# Altium project PROC114E3_SCH.PrjPcb (part 9 of 22)

## Sheet 22.SchDoc
size 513 x 386 mm
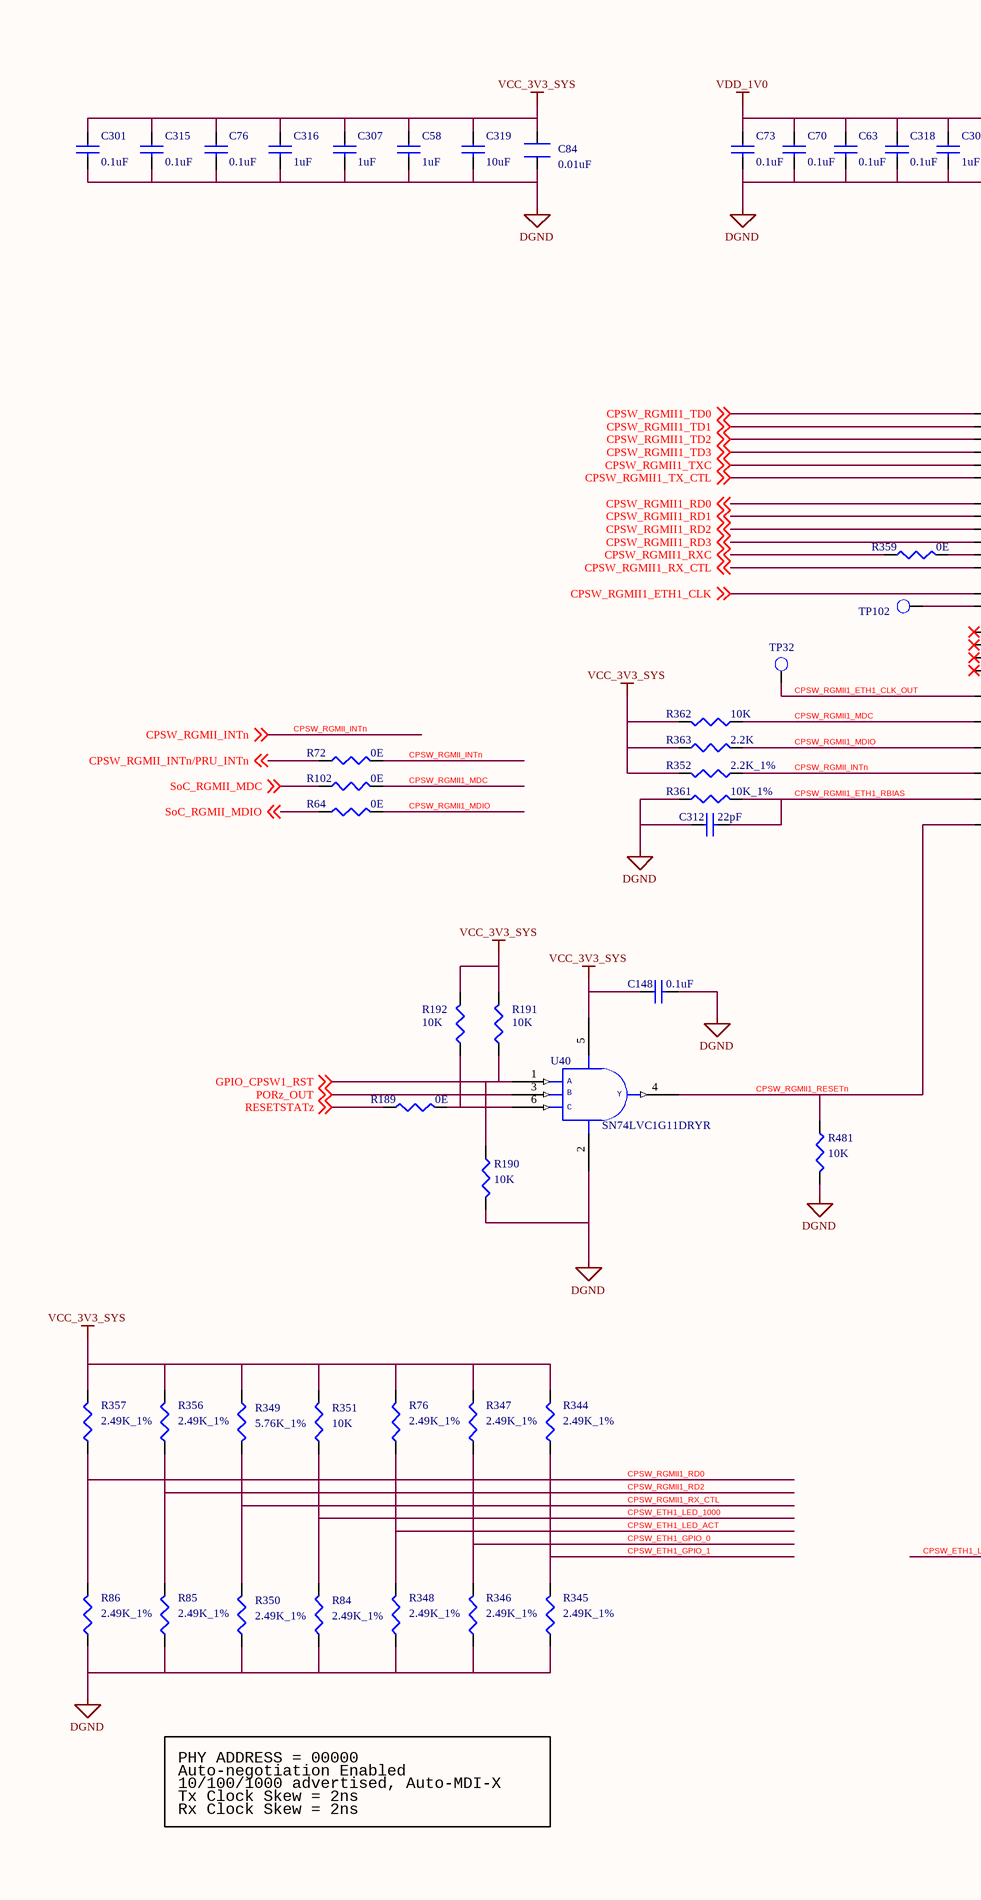
[diagram p33: 22.SchDoc, left]
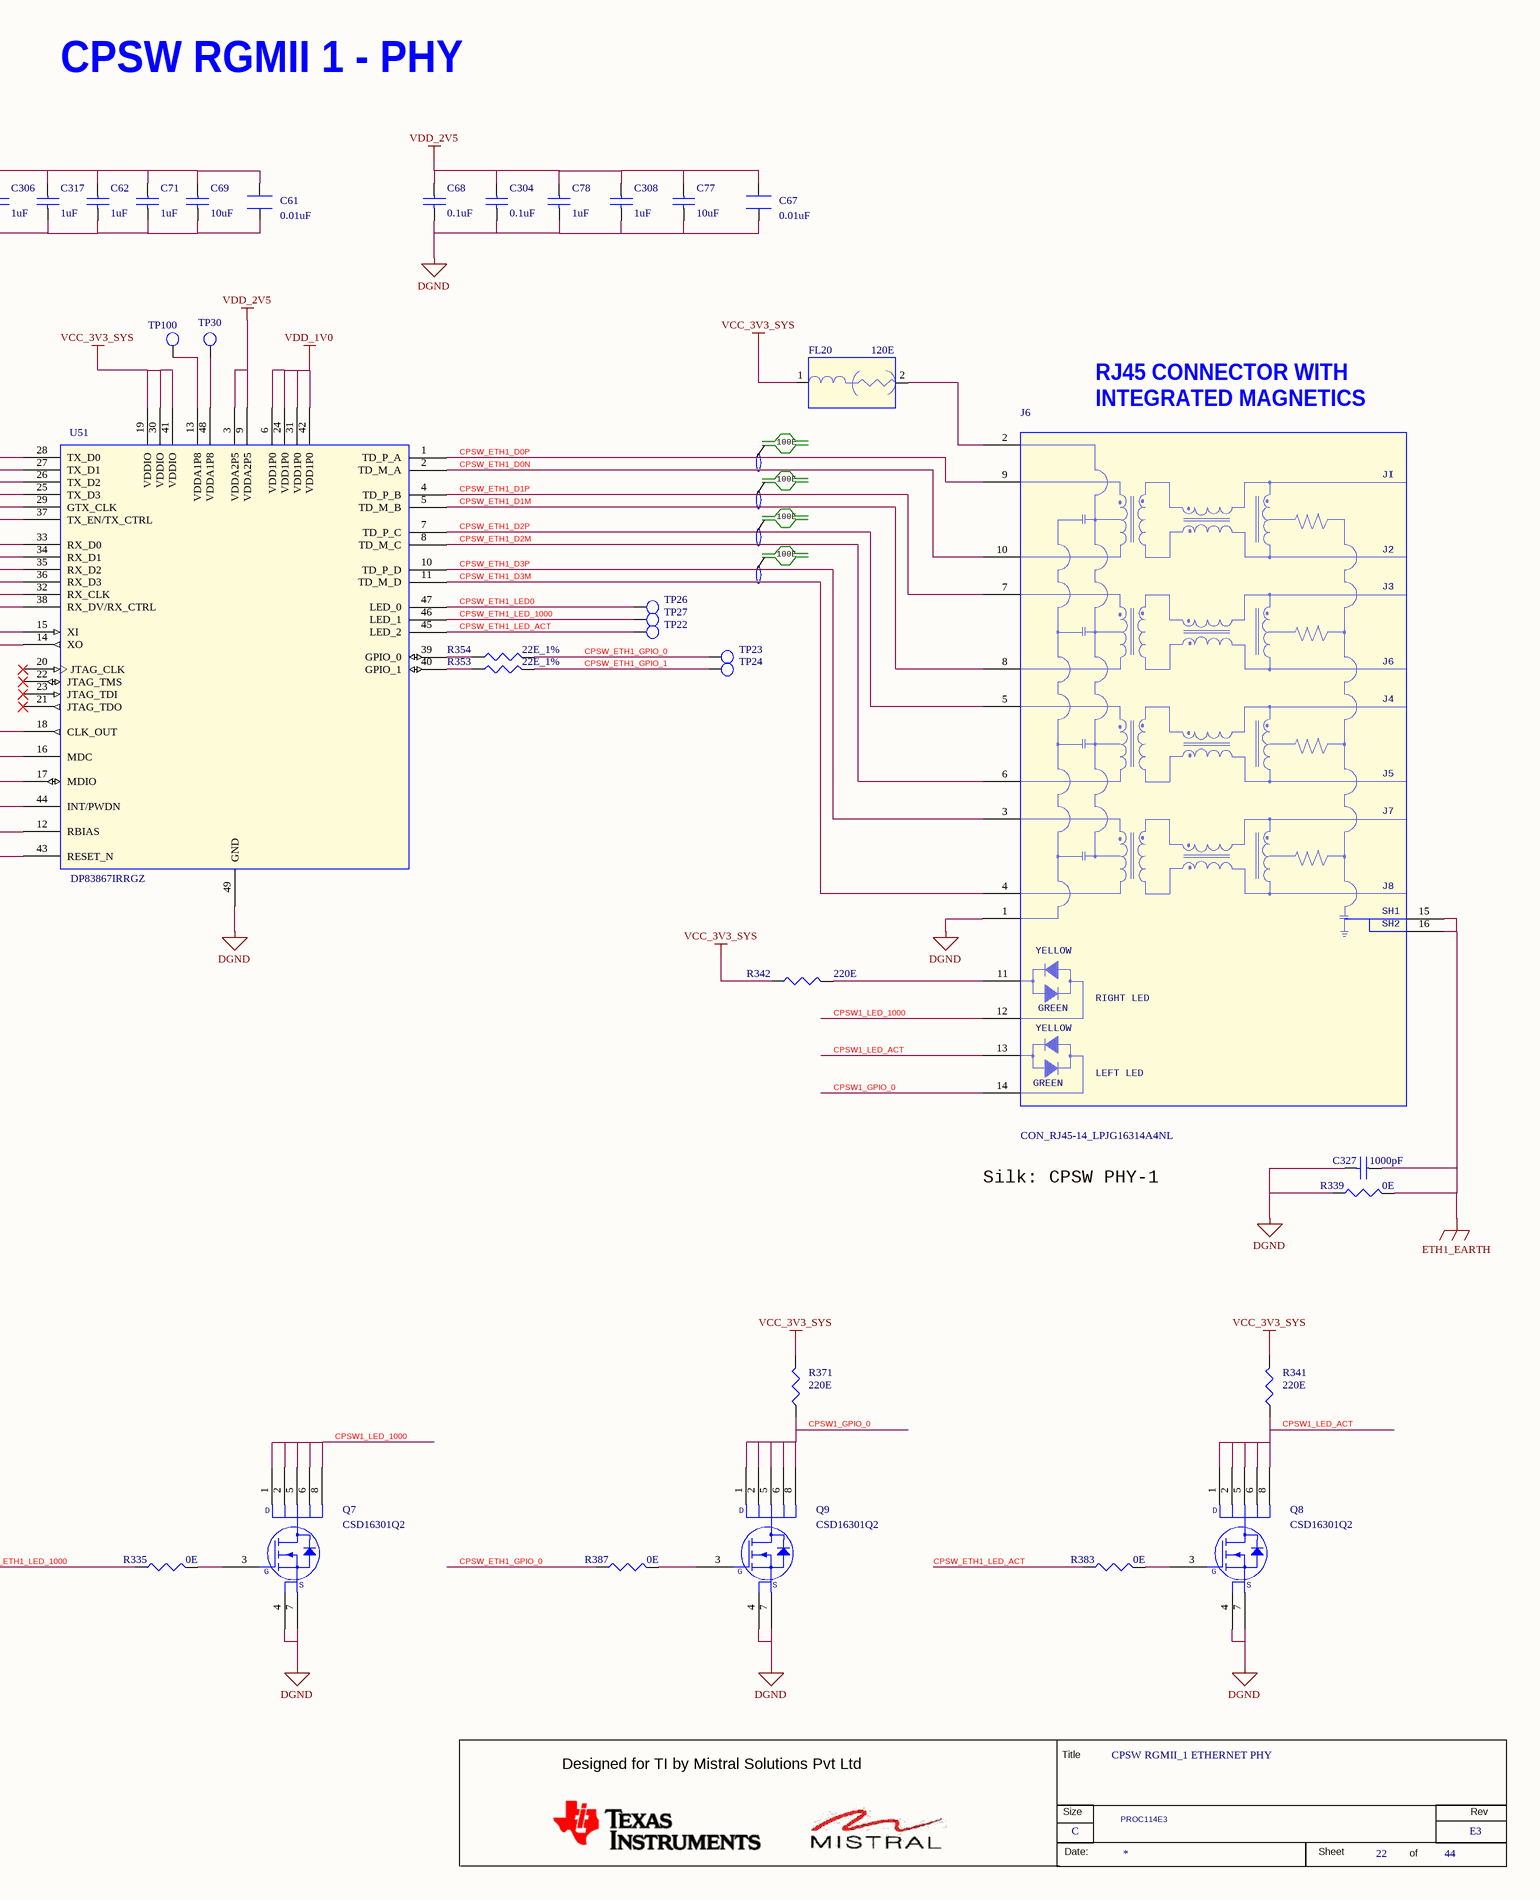
[diagram p34: 22.SchDoc, right]

### Parts
(Parts that share a designator on the sheet are numbered #1, #2 ... from top to bottom, then left to right.)
*#22  RevCode: E3  Title: CPSW RGMII_1 ETHERNET PHY  Page Size: C  Page Number: 22  Page Count: 44  Variant Name: PROC114E3  (hidden comment: MISTRAL_TITLEBLK_CSIZE)  (graphical)
C58  1uF  [CAP0201_0-5]
C61  0.01uF  [CAP0402N]
C62  1uF  [CAP0201_0-5]
C63  0.1uF  [CAP0201_0-5]
C67  0.01uF  [CAP0402N]
C68  0.1uF  [CAP0201_0-5]
C69  10uF  [CAP0402_0-75]
C70  0.1uF  [CAP0201_0-5]
C71  1uF  [CAP0201_0-5]
C73  0.1uF  [CAP0201_0-5]
C76  0.1uF  [CAP0201_0-5]
C77  10uF  [CAP0402_0-75]
C78  1uF  [CAP0201_0-5]
C84  0.01uF  [CAP0402N]
C148  0.1uF  [CAP0201_0-5]
C301  0.1uF  [CAP0201_0-5]
C304  0.1uF  [CAP0201_0-5]
C306  1uF  [CAP0201_0-5]
C307  1uF  [CAP0201_0-5]
C308  1uF  [CAP0201_0-5]
C312  22pF  [CAP0201_0-5]
C315  0.1uF  [CAP0201_0-5]
C316  1uF  [CAP0201_0-5]
C317  1uF  [CAP0201_0-5]
C318  0.1uF  [CAP0201_0-5]
C319  10uF  [CAP0402_0-75]
C327  1000pF  [CAP1206_1-75]
FL20  120E  [EMIFIL_BLM15P_0402]
J6  CON_RJ45-14_LPJG16314A4NL  [CON_RJ45-14_LPJG16314A4NL_S_R_T_13-6]
Q7  CSD16301Q2  [WSON6_CSD13202Q2_80X80_0-8]
Q8  CSD16301Q2  [WSON6_CSD13202Q2_80X80_0-8]
Q9  CSD16301Q2  [WSON6_CSD13202Q2_80X80_0-8]
R64  0E  [RES0402_0-5]
R72  0E  [RES0402_0-5]
R76  2.49K_1%  [RES0402_0-5]
R84  2.49K_1%  [RES0402_0-5]
R85  2.49K_1%  [RES0402_0-5]
R86  2.49K_1%  [RES0402_0-5]
R102  0E  [RES0402_0-5]
R189  0E  [RES0402_0-5]
R190  10K  [RES0201_0-5]
R191  10K  [RES0201_0-5]
R192  10K  [RES0201_0-5]
R335  0E  [RES0402_0-5]
R339  0E  [RES0603_0-75]
R341  220E  [RES0402_0-5]
R342  220E  [RES0402_0-5]
R344  2.49K_1%  [RES0402_0-5]
R345  2.49K_1%  [RES0402_0-5]
R346  2.49K_1%  [RES0402_0-5]
R347  2.49K_1%  [RES0402_0-5]
R348  2.49K_1%  [RES0402_0-5]
R349  5.76K_1%  [RES0402_0-5]
R350  2.49K_1%  [RES0402_0-5]
R351  10K  [RES0201_0-5]
R352  2.2K_1%  [RES0201_0-5]
R353  22E_1%  [RES0201_0-5]
R354  22E_1%  [RES0201_0-5]
R356  2.49K_1%  [RES0402_0-5]
R357  2.49K_1%  [RES0402_0-5]
R359  0E  [RES0402_0-5]
R361  10K_1%  [RES0201_0-5]
R362  10K  [RES0201_0-5]
R363  2.2K  [RES0201_0-5]
R371  220E  [RES0402_0-5]
R383  0E  [RES0402_0-5]
R387  0E  [RES0402_0-5]
R481  10K  [RES0201_0-5]
TP22  TP20_SMD  [TP20_SMD]  (value not drawn)
TP23  TP20_SMD  [TP20_SMD]  (value not drawn)
TP24  TP20_SMD  [TP20_SMD]  (value not drawn)
TP26  TP20_SMD  [TP20_SMD]  (value not drawn)
TP27  TP20_SMD  [TP20_SMD]  (value not drawn)
TP30  TP20_SMD  [TP20_SMD]  (value not drawn)
TP32  TP20_SMD  [TP20_SMD]  (value not drawn)
TP100  TP20_SMD  [TP20_SMD]  (value not drawn)
TP102  TP20_SMD  [TP20_SMD]  (value not drawn)
U40  SN74LVC1G11DRYR  [SON6_SN74LVC2G17_40X60_0-6]
U51  DP83867IRRGZ  [QFN48_19-68_280X280_1]

### Nets
DGND: C58.2 C61.2 C62.2 C63.2 C67.2 C68.2 C69.2 C70.2 C71.2 C73.2 C76.2 C77.2 C78.2 C84.2 C148.2 C301.2 C304.2 C306.2 C307.2 C308.2 C312.1 C315.2 C316.2 C317.2 C318.2 C319.2 C327.2 J6.1(CH-GND) Q7.4(S1) Q7.7(S2) Q8.4(S1) Q8.7(S2) Q9.4(S1) Q9.7(S2) R84.1 R85.1 R86.1 R190.2 R339.2 R345.1 R346.1 R348.1 R350.1 R361.2 R481.2 U40.2(GND) U51.49(GND)
ETH1_EARTH: C327.1 J6.15(SH1) J6.16(SH2) R339.1
VCC_3V3_SYS: C58.1 C76.1 C84.1 C148.1 C301.1 C307.1 C315.1 C316.1 C319.1 FL20.1 R76.2 R191.2 R192.2 R341.2 R342.1 R344.2 R347.2 R349.1 R351.2 R352.2 R356.2 R357.2 R362.2 R363.1 R371.2 U40.5(VCC) U51.19(VDDIO) U51.30(VDDIO) U51.41(VDDIO)
VDD_1V0: C61.1 C62.1 C63.1 C69.1 C70.1 C71.1 C73.1 C306.1 C317.1 C318.1 U51.6(VDD1P0) U51.24(VDD1P0) U51.31(VDD1P0) U51.42(VDD1P0)
VDD_2V5: C67.1 C68.1 C77.1 C78.1 C304.1 C308.1 U51.3(VDDA2P5) U51.9(VDDA2P5)
CPSW1_GPIO_0: J6.14 Q9.1(D1) Q9.2(D2) Q9.5(D3) Q9.6(D4) Q9.8(D5) R371.1
CPSW1_LED_1000: J6.12 Q7.1(D1) Q7.2(D2) Q7.5(D3) Q7.6(D4) Q7.8(D5)
CPSW1_LED_ACT: J6.13 Q8.1(D1) Q8.2(D2) Q8.5(D3) Q8.6(D4) Q8.8(D5) R341.1
CPSW_ETH1_D0N: J6.10(MX0-) U51.2(TD_M_A)
CPSW_ETH1_D0P: J6.9(MX0+) U51.1(TD_P_A)
CPSW_ETH1_D1M: J6.8(MX1-) U51.5(TD_M_B)
CPSW_ETH1_D1P: J6.7(MX1+) U51.4(TD_P_B)
CPSW_ETH1_D2M: J6.6(MX2-) U51.8(TD_M_C)
CPSW_ETH1_D2P: J6.5(MX2+) U51.7(TD_P_C)
CPSW_ETH1_D3M: J6.4(MX3-) U51.11(TD_M_D)
CPSW_ETH1_D3P: J6.3(MX3+) U51.10(TD_P_D)
CPSW_ETH1_GPIO_0: R346.2 R347.1 R354.1 R387.1 TP23.1(TP)
CPSW_ETH1_GPIO_1: R344.1 R345.2 R353.1 TP24.1(TP)
CPSW_ETH1_LED0: TP26.1(TP) U51.47(LED_0)
CPSW_ETH1_LED_1000: R84.2 R335.1 R351.1 TP27.1(TP) U51.46(LED_1)
CPSW_ETH1_LED_ACT: R76.1 R348.2 R383.1 TP22.1(TP) U51.45(LED_2)
CPSW_RGMII1_ETH1_CLK: U51.15(XI) ; off-sheet CPSW_RGMII1_ETH1_CLK
CPSW_RGMII1_ETH1_CLK_OUT: TP32.1(TP) U51.18(CLK_OUT)
CPSW_RGMII1_ETH1_RBIAS: C312.2 R361.1 U51.12(RBIAS)
CPSW_RGMII1_MDC: R102.2 R362.1 U51.16(MDC)
CPSW_RGMII1_MDIO: R64.2 R363.2 U51.17(MDIO)
CPSW_RGMII1_RD0: R86.2 R357.1 U51.33(RX_D0) ; off-sheet CPSW_RGMII1_RD0
CPSW_RGMII1_RD1: U51.34(RX_D1) ; off-sheet CPSW_RGMII1_RD1
CPSW_RGMII1_RD2: R85.2 R356.1 U51.35(RX_D2) ; off-sheet CPSW_RGMII1_RD2
CPSW_RGMII1_RD3: U51.36(RX_D3) ; off-sheet CPSW_RGMII1_RD3
CPSW_RGMII1_RESETn: R481.1 U40.4(Y) U51.43(RESET_N)
CPSW_RGMII1_RX_CTL: R349.2 R350.2 U51.38(RX_DV/RX_CTRL) ; off-sheet CPSW_RGMII1_RX_CTL
CPSW_RGMII1_RXC: R359.1 ; off-sheet CPSW_RGMII1_RXC
CPSW_RGMII1_TD0: U51.28(TX_D0) ; off-sheet CPSW_RGMII1_TD0
CPSW_RGMII1_TD1: U51.27(TX_D1) ; off-sheet CPSW_RGMII1_TD1
CPSW_RGMII1_TD2: U51.26(TX_D2) ; off-sheet CPSW_RGMII1_TD2
CPSW_RGMII1_TD3: U51.25(TX_D3) ; off-sheet CPSW_RGMII1_TD3
CPSW_RGMII1_TX_CTL: U51.37(TX_EN/TX_CTRL) ; off-sheet CPSW_RGMII1_TX_CTL
CPSW_RGMII1_TXC: U51.29(GTX_CLK) ; off-sheet CPSW_RGMII1_TXC
CPSW_RGMII_INTn: R72.2 R352.1 U51.44(INT/PWDN) ; off-sheet CPSW_RGMII_INTn
CPSW_RGMII_INTn/PRU_INTn: R72.1 ; off-sheet CPSW_RGMII_INTn/PRU_INTn
GPIO_CPSW1_RST: R190.1 R191.1 U40.1(A) ; off-sheet GPIO_CPSW1_RST
PORz_OUT: U40.3(B) ; off-sheet PORz_OUT
RESETSTATz: R189.1 ; off-sheet RESETSTATz
SoC_RGMII_MDC: R102.1 ; off-sheet SoC_RGMII_MDC
SoC_RGMII_MDIO: R64.1 ; off-sheet SoC_RGMII_MDIO
NetFL20_2: FL20.2 J6.2(VCC)
NetJ6_11: J6.11 R342.2
NetQ7_3: Q7.3(G) R335.2
NetQ8_3: Q8.3(G) R383.2
NetQ9_3: Q9.3(G) R387.2
NetR189_2: R189.2 R192.1 U40.6(C)
NetR353_2: R353.2 U51.40(GPIO_1)
NetR354_2: R354.2 U51.39(GPIO_0)
NetR359_2: R359.2 U51.32(RX_CLK)
NetTP30_1: TP30.1(TP) U51.48(VDDA1P8)
NetTP100_1: TP100.1(TP) U51.13(VDDA1P8)
NetTP102_1: TP102.1(TP) U51.14(XO)

Not connected (* = marked no-connect by the designer): U51 20(JTAG_CLK)* 21(JTAG_TDO)* 22(JTAG_TMS)* 23(JTAG_TDI)*

### Notes on the sheet
- CPSW RGMII 1 - PHY
- (near J6) RJ45 CONNECTOR WITH
  INTEGRATED MAGNETICS
- 100E
- Silk: CPSW PHY-1
- Auto-negotiation Enabled
- PHY ADDRESS = 00000
- Rx Clock Skew = 2ns
- Tx Clock Skew = 2ns
- 10/100/1000 advertised, Auto-MDI-X
- (in symbol CON_RJ45-14_LPJG16314A4NL) JI; J2; J3; J4; J5; J7; J8; YELLOW; RIGHT LED; GREEN; LEFT LED
- (in symbol MISTRAL_TITLEBLK_CSIZE) Title; Designed for TI by Mistral Solutions Pvt Ltd; Size; Rev; Date:; Sheet; of
- (in symbol MOSFET_CSD17313Q2) D; S

### Library data of the parts
*#22 = MISTRAL_TITLEBLK_CSIZE: Issue: 1.0; Page Create Date: March  8, 1995; Page Modify Date: *; Schematic Page Count: 44; Schematic Page Number: 22
C58 C62 C306 = CAP_Dup2: as C47 on sheet 19; Chkd/date: MANIRAJA/300520; Crtd /date: ALVY/260520; Datasheet: Y:\MIS_DATABASE\DATASHEETS\CAPACITORS\GRM033R61C105ME15.PDF; Temperature: -55°C+85°C; Weight: 0.33mg; Height: 0.39MM; Distributor_part_number: 490-18654-1-ND; Distributor_name: DIGIKEY; Package: 0201; Voltage: 16V; Tolerance: 20%; MECHANICAL 3D STEP FILE: CAP0201_0-5; Library Path: Y:\MIS_DATABASE\Library\ALTIUM_TOOL\SCHEMATICS_PARTS\MS_DISCRETE_Library.schlib; Footprint Path: Y:\MIS_DATABASE\Library\ALTIUM_TOOL\PCB_FOOTPRINTS\Altium_Footprint_Lib.PcbLib; Library Ref: CAP; Footprint Ref: CAP0201_0-5; PCB Footprint: CAP0201_0-5
C61 C84 = CAP_Dup3: CAP CERAMIC 0.01uF 25V 10% X5R 0201; Mistral Part No: 120018010007-R; Mfr_name: MURATA; Mfr_part_number: GRM033R61E103KA12J; Part_type: CAPACITORS\CERAMIC; Project: TI_MAXIE_CPB; Customs_HS_Code: 85322990; Custom_Duty: 15%; Wattage: NA; MECHANICAL 3D STEP FILE: CAP0201_0-5; Library Ref: CAP; Tolerance: 10%; Voltage: 25V; Package: 0201; Distributor_name: DIGIKEY; Distributor_part_number: GRM033R61E103KA12J-ND; Height: 0.33MM; Datasheet: Y:\MIS_DATABASE\DATASHEETS\CAPACITORS\GRM033R61E103KA12.PDF; Crtd /date: MANIRAJA/230118; Chkd/date: MANIRAJA/230118; Weight: 0.33mg; Temperature: -55°C+85°C; Footprint Ref: CAP0201_0-5; Library Path: Y:\MIS_DATABASE\Library\ALTIUM_TOOL\SCHEMATICS_PARTS\MS_DISCRETE_Library.schlib; Footprint Path: Y:\MIS_DATABASE\Library\ALTIUM_TOOL\PCB_FOOTPRINTS\Altium_Footprint_Lib.PcbLib; PCB Footprint: CAP0201_0-5
C63 C70 C73 C76 C301 C318 = CAP_Dup2: CAP CERAMIC 0.1uF 16V 10% X5R 0201; Alt_Mfr_part_number: CC0402KRX5R8BB104; Mistral Part No: 120009030072-R; Mfr_name: MURATA; Mfr_part_number: GRM033R61C104KE14D; Part_type: CAPACITORS\CERAMIC; Alt_Mfr_name: YAGEO AMERICA; Project: TI_MAXIE_CPB; Wattage: NA; Customs_HS_Code: 85322990; Custom_Duty: 15%; Tolerance: 10%; Voltage: 16V; Package: 0201; Distributor_name: DIGIKEY; Distributor_part_number: 490-14305-1-ND; Height: 0.33MM; Weight: 0.33mg; Temperature: -55°C+85°C; Datasheet: Y:\MIS_DATABASE\DATASHEETS\CAPACITORS\GRM033R61C104KE14.PDF; Crtd /date: MANIRAJA/230118; Chkd/date: MANIRAJA/230118; MECHANICAL 3D STEP FILE: CAP0201_0-5; Library Ref: CAP; Footprint Ref: CAP0201_0-5; Library Path: Y:\MIS_DATABASE\Library\ALTIUM_TOOL\SCHEMATICS_PARTS\MS_DISCRETE_Library.schlib; Footprint Path: Y:\MIS_DATABASE\Library\ALTIUM_TOOL\PCB_FOOTPRINTS\Altium_Footprint_Lib.PcbLib; PCB Footprint: CAP0201_0-5
C67 = CAP_Dup3: CAP CERAMIC 0.01uF 25V 10% X5R 0201; Part_type: CAPACITORS\CERAMIC; Mfr_part_number: GRM033R61E103KA12J; Mfr_name: MURATA; Mistral Part No: 120018010007-R; MECHANICAL 3D STEP FILE: CAP0201_0-5; Wattage: NA; Custom_Duty: 15%; Customs_HS_Code: 85322990; Project: TI_MAXIE_CPB; Footprint Path: Y:\MIS_DATABASE\Library\ALTIUM_TOOL\PCB_FOOTPRINTS\Altium_Footprint_Lib.PcbLib; Library Path: Y:\MIS_DATABASE\Library\ALTIUM_TOOL\SCHEMATICS_PARTS\MS_DISCRETE_Library.schlib; Footprint Ref: CAP0201_0-5; Temperature: -55°C+85°C; Weight: 0.33mg; Chkd/date: MANIRAJA/230118; Crtd /date: MANIRAJA/230118; Datasheet: Y:\MIS_DATABASE\DATASHEETS\CAPACITORS\GRM033R61E103KA12.PDF; Height: 0.33MM; Distributor_part_number: GRM033R61E103KA12J-ND; Distributor_name: DIGIKEY; Package: 0201; Voltage: 25V; Tolerance: 10%; Library Ref: CAP; PCB Footprint: CAP0201_0-5
C68 C148 C304 C315 = CAP_Dup2: CAP CERAMIC 0.1uF 16V 10% X5R 0201; Alt_Mfr_name: YAGEO AMERICA; Part_type: CAPACITORS\CERAMIC; Mfr_part_number: GRM033R61C104KE14D; Mfr_name: MURATA; Mistral Part No: 120009030072-R; Alt_Mfr_part_number: CC0402KRX5R8BB104; Custom_Duty: 15%; Customs_HS_Code: 85322990; Wattage: NA; Project: TI_MAXIE_CPB; Footprint Path: Y:\MIS_DATABASE\Library\ALTIUM_TOOL\PCB_FOOTPRINTS\Altium_Footprint_Lib.PcbLib; Library Path: Y:\MIS_DATABASE\Library\ALTIUM_TOOL\SCHEMATICS_PARTS\MS_DISCRETE_Library.schlib; Footprint Ref: CAP0201_0-5; Library Ref: CAP; MECHANICAL 3D STEP FILE: CAP0201_0-5; Chkd/date: MANIRAJA/230118; Crtd /date: MANIRAJA/230118; Datasheet: Y:\MIS_DATABASE\DATASHEETS\CAPACITORS\GRM033R61C104KE14.PDF; Temperature: -55°C+85°C; Weight: 0.33mg; Height: 0.33MM; Distributor_part_number: 490-14305-1-ND; Distributor_name: DIGIKEY; Package: 0201; Voltage: 16V; Tolerance: 10%; PCB Footprint: CAP0201_0-5
C69 C77 = CAP_Dup2: CAP CERAMIC 10uF 10V 20% X5R 0402; Mistral Part No: 120013110019-R; Mfr_name: MURATA; Mfr_part_number: GRM155R61A106ME11D; Part_type: CAPACITORS\CERAMIC; Project: QCS610_NANOSOM; Customs_HS_Code: 85322990; Custom_Duty: 15%; Wattage: NA; Library Ref: CAP; Tolerance: 20%; Voltage: 10V; Package: 0402; Distributor_name: DIGIKEY; Distributor_part_number: 490-GRM155R61A106ME11DTR-ND; Height: 0.55MM; Datasheet: Y:\MIS_DATABASE\DATASHEETS\CAPACITORS\MURATA-GXX-SER_NOV17.PDF; Crtd /date: ALVY/260520; Chkd/date: MANIRAJA/300520; Weight: 3.1mg; Temperature: -55°C+85°C; MECHANICAL 3D STEP FILE: CAP0402_0-75; Footprint Ref: CAP0402_0-75; Library Path: Y:\MIS_DATABASE\Library\ALTIUM_TOOL\SCHEMATICS_PARTS\MS_DISCRETE_Library.schlib; Footprint Path: Y:\MIS_DATABASE\Library\ALTIUM_TOOL\PCB_FOOTPRINTS\Altium_Footprint_Lib.PcbLib; PCB Footprint: CAP0402_0-75
C71 C78 C307 C308 C316 C317 = CAP_Dup2: CAP CERAMIC 1uF 16V 20% X5R 0201; Mistral Part No: 120018090038-R; Mfr_name: MURATA; Mfr_part_number: GRM033R61C105ME15D; Part_type: CAPACITORS\CERAMIC; Project: QCS610_NANOSOM; Wattage: NA; Customs_HS_Code: 85322990; Custom_Duty: 15%; Footprint Ref: CAP0201_0-5; Library Ref: CAP; Footprint Path: Y:\MIS_DATABASE\Library\ALTIUM_TOOL\PCB_FOOTPRINTS\Altium_Footprint_Lib.PcbLib; Library Path: Y:\MIS_DATABASE\Library\ALTIUM_TOOL\SCHEMATICS_PARTS\MS_DISCRETE_Library.schlib; MECHANICAL 3D STEP FILE: CAP0201_0-5; Tolerance: 20%; Voltage: 16V; Package: 0201; Distributor_name: DIGIKEY; Distributor_part_number: 490-18654-1-ND; Height: 0.39MM; Weight: 0.33mg; Temperature: -55°C+85°C; Datasheet: Y:\MIS_DATABASE\DATASHEETS\CAPACITORS\GRM033R61C105ME15.PDF; Crtd /date: ALVY/260520; Chkd/date: MANIRAJA/300520; PCB Footprint: CAP0201_0-5
C312 = CAP_Dup2: CAP CERAMIC 22pF 25V 1% C0G(NP0) 0201; Mistral Part No: 120021070019-R; Mfr_name: MURATA; Mfr_part_number: GRM0335C1E220FA01D; Part_type: CAPACITORS\CERAMIC; Project: TI_AM335x SK_BRD; Wattage: NA; Customs_HS_Code: 85322990; Custom_Duty: 15%; Footprint Ref: CAP0201_0-5; Tolerance: 1%; Voltage: 25V; Package: 0201; Distributor_name: DIGIKEY; Distributor_part_number: 490-14545-1-ND; Library Ref: CAP; Height: 0.33MM; Weight: 0.33mg; Temperature: -55°C+125°C; Datasheet: Y:\MIS_DATABASE\DATASHEETS\CAPACITORS\GRM0335C1E220FA01.PDF; Crtd /date: ALVY/260721; Chkd/date: MANIRAJA/270721; MECHANICAL 3D STEP FILE: CAP0201_0-5; Library Path: Y:\MIS_DATABASE\Library\ALTIUM_TOOL\SCHEMATICS_PARTS\MS_DISCRETE_Library.schlib; Footprint Path: Y:\MIS_DATABASE\Library\ALTIUM_TOOL\PCB_FOOTPRINTS\Altium_Footprint_Lib.PcbLib; PCB Footprint: CAP0201_0-5
C319 = CAP_Dup2: CAP CERAMIC 10uF 10V 20% X5R 0402; Mistral Part No: 120013110019-R; Mfr_name: MURATA; Mfr_part_number: GRM155R61A106ME11D; Part_type: CAPACITORS\CERAMIC; Wattage: NA; Project: QCS610_NANOSOM; Customs_HS_Code: 85322990; Custom_Duty: 15%; Footprint Path: Y:\MIS_DATABASE\Library\ALTIUM_TOOL\PCB_FOOTPRINTS\Altium_Footprint_Lib.PcbLib; Library Path: Y:\MIS_DATABASE\Library\ALTIUM_TOOL\SCHEMATICS_PARTS\MS_DISCRETE_Library.schlib; Footprint Ref: CAP0402_0-75; Library Ref: CAP; MECHANICAL 3D STEP FILE: CAP0402_0-75; Temperature: -55°C+85°C; Weight: 3.1mg; Tolerance: 20%; Voltage: 10V; Package: 0402; Distributor_name: DIGIKEY; Distributor_part_number: 490-GRM155R61A106ME11DTR-ND; Height: 0.55MM; Datasheet: Y:\MIS_DATABASE\DATASHEETS\CAPACITORS\MURATA-GXX-SER_NOV17.PDF; Crtd /date: ALVY/260520; Chkd/date: MANIRAJA/300520; PCB Footprint: CAP0402_0-75
C327 = CAP_Dup2: CAP CERAMIC 1000pF 2KV 10% X7R 1206; Mistral Part No: 120015080006-R; Mfr_name: AVX CORPORATION; Mfr_part_number: 1206GC102KAT1A; Part_type: CAPACITORS\CERAMIC; Project: ADR1B; Customs_HS_Code: 85322990; Custom_Duty: 15%; Wattage: NA; Tolerance: 10%; Voltage: 2KV; Package: 1206; Distributor_name: DIGIKEY; Distributor_part_number: 478-2956-1-ND; Height: 1.52MM; Weight: 16.2mg; Temperature: -55°C+125°C; Datasheet: Y:\MIS_DATABASE\DATASHEETS\CAPACITORS\AVX_HV-MLC.PDF; Crtd /date: MAZHAR/281106; Chkd/date: SHREESHAIL/291106; Library Ref: CAP; Footprint Ref: CAP1206_1-75; Library Path: Y:\MIS_DATABASE\Library\ALTIUM_TOOL\SCHEMATICS_PARTS\MS_DISCRETE_Library.schlib; Footprint Path: Y:\MIS_DATABASE\Library\ALTIUM_TOOL\PCB_FOOTPRINTS\Altium_Footprint_Lib.PcbLib; MECHANICAL 3D STEP FILE: CAP1206_1-75; PCB Footprint: CAP1206_1-75
FL20 = EMIFILTER_IND: FERRITE CHIP 120E 2A 0402; Part_type: FILTER; Mfr_part_number: BLM15PX121SN1D; Mfr_name: MURATA; Mistral Part No: 130013060022-R; Custom_Duty: 24%; Customs_HS_Code: 85369090; Wattage: NA; Tolerance: 25%; Project: GEN_3-8; Chkd/date: NAVEED/241114; Crtd /date: USMAN/170613; Datasheet: Y:\MIS_DATABASE\DATASHEETS\DISCRETES\INDUCTORS\BLM15X.PDF; Temperature: -55°C+125°C; Weight: NA; Height: 0.55MM; Library Ref: EMIFILTER_IND; Distributor_part_number: 81-BLM15PX121SN1D; Distributor_name: MOUSER; Package: 0402; Voltage: NA; PCB Footprint: EMIFIL_BLM15P_0402
J6 = CON_RJ45-14_LPJG16314A4NL: CON RJ-45 FEMALE 14POS RT TH; Mistral Part No: 150014060029-R; Mfr_name: LINK-PP; Part_type: CONNECTOR\JACK; Project: AEGIS; Tolerance: NA; Customs_HS_Code: 85369090; Custom_Duty: 24%; Mfr_part_number: LPJG16314A4NL; Voltage: NA; Wattage: NA; Package: THRU-HOLE; Distributor_name: NA; Distributor_part_number: NA; Library Ref: CON_RJ45-14_LPJG16314A4NL; Footprint Ref: CON_RJ45-14_LPJG16314A4NL_S_R_T_13-6; Height: 13.60MM; Weight: NA; Temperature: -0°C+70°C; Datasheet: Y:\MIS_DATABASE\DATASHEETS\CONNECTORS\LPJG16314A4NL.PDF; Crtd /date: BALACHANDAR/120614; Chkd/date: VASANTHA/150714; MECHANICAL 3D STEP FILE: CON_RJ45-14_LPJG16314A4NL_S_R_T_13-6; Library Path: Y:\MIS_DATABASE\Library\ALTIUM_TOOL\SCHEMATICS_PARTS\MS_CONNECTOR_Library.schlib; Footprint Path: Y:\MIS_DATABASE\Library\ALTIUM_TOOL\PCB_FOOTPRINTS\Altium_Footprint_Lib.PcbLib; PCB Footprint: CON_RJ45-14_LPJG16314A4NL_S_R_T_13-6
Q7-Q9 = MOSFET_CSD17313Q2: IC MOSFET N-CHANNEL NEXFET 25V WSON6; Mistral Part No: 142020120008-R; Mfr_name: TEXAS INSTRUMENTS; Part_type: ICS\POWER\MOSFET; Project: TI_AM243x LP EVM; Tolerance: NA; Customs_HS_Code: 85423100; Custom_Duty: 15%; Footprint Ref: WSON6_CSD13202Q2_80X80_0-8; Mfr_part_number: CSD16301Q2; Voltage: NA; Wattage: NA; Package: WSON6; Distributor_name: DIGIKEY; Distributor_part_number: 296-25260-1-ND; Library Ref: MOSFET_CSD17313Q2; PCB Footprint: WSON6_CSD13202Q2_80X80_0-8; Height: 0.80MM; Weight: 8.7mg; Temperature: -55°C+150°C; Datasheet: Y:\MIS_DATABASE\DATASHEETS\ICS\POWER\CSD16301Q2.PDF; Crtd /date: MANIRAJA/071220; Chkd/date: ALVY/071220; MECHANICAL 3D STEP FILE: WSON6_CSD13202Q2_80X80_0-8; Library Path: Y:\MIS_DATABASE\Library\ALTIUM_TOOL\SCHEMATICS_PARTS\MS_MOSFET_Library.schlib; Footprint Path: Y:\MIS_DATABASE\Library\ALTIUM_TOOL\PCB_FOOTPRINTS\Altium_Footprint_Lib.PcbLib
R64 R102 R383 R387 = RESISTOR_Dup6: as R321 on sheet 20; Footprint Path: Y:\MIS_DATABASE\Library\ALTIUM_TOOL\PCB_FOOTPRINTS\Altium_Footprint_Lib.PcbLib; Library Path: Y:\MIS_DATABASE\Library\ALTIUM_TOOL\SCHEMATICS_PARTS\MS_DISCRETE_Library.schlib; MECHANICAL 3D STEP FILE: RES0402_0-5; Chkd/date: VASANTHA/201216; Crtd /date: MUDDU/190810; Datasheet: Y:\MIS_DATABASE\DATASHEETS\RESISTORS\CRCW0603.PDF; Temperature: -55°C+155°C; Weight: 0.65mg; Height: 0.40MM; Library Ref: RESISTOR; Distributor_part_number: 541-0.0JCT-ND; Distributor_name: DIGIKEY; Package: 0402; Wattage: 1/16W; Tolerance: NA; Footprint Ref: RES0402_0-5; PCB Footprint: RES0402_0-5
R72 R335 = RESISTOR_Dup6: RES 0E 1/16W JUMPER 0402; Mistral Part No: 110010080019-R; Mfr_name: VISHAY; Mfr_part_number: CRCW04020000Z0ED; Part_type: RESISTORS\FIXED; Project: PB_BUGBASE; Tolerance: NA; Customs_HS_Code: 85332119; Custom_Duty: 15%; Footprint Ref: RES0402_0-5; Voltage: NA; Wattage: 1/16W; Package: 0402; Distributor_name: DIGIKEY; Distributor_part_number: 541-0.0JCT-ND; Library Ref: RESISTOR; Height: 0.40MM; Weight: 0.65mg; Temperature: -55°C+155°C; Datasheet: Y:\MIS_DATABASE\DATASHEETS\RESISTORS\CRCW0603.PDF; Crtd /date: MUDDU/190810; Chkd/date: VASANTHA/201216; MECHANICAL 3D STEP FILE: RES0402_0-5; Library Path: Y:\MIS_DATABASE\Library\ALTIUM_TOOL\SCHEMATICS_PARTS\MS_DISCRETE_Library.schlib; Footprint Path: Y:\MIS_DATABASE\Library\ALTIUM_TOOL\PCB_FOOTPRINTS\Altium_Footprint_Lib.PcbLib; PCB Footprint: RES0402_0-5
R76 R85 R86 R344-R348 R350 R356 R357 = RESISTOR_Dup6: RES 2.49K 1/16W 1% 0402; Mistral Part No: 110016050020-R; Mfr_name: YAGEO AMERICA; Mfr_part_number: RC0402FR-072K49L; Part_type: RESISTORS\FIXED; Project: TMDXCSKCC; Voltage: NA; Customs_HS_Code: 85332119; Custom_Duty: 15%; Footprint Path: Y:\MIS_DATABASE\Library\ALTIUM_TOOL\PCB_FOOTPRINTS\Altium_Footprint_Lib.PcbLib; Library Path: Y:\MIS_DATABASE\Library\ALTIUM_TOOL\SCHEMATICS_PARTS\MS_DISCRETE_Library.schlib; MECHANICAL 3D STEP FILE: RES0402_0-5; Footprint Ref: RES0402_0-5; Tolerance: 1%; Wattage: 1/16W; Package: 0402; Distributor_name: DIGIKEY; Distributor_part_number: 311-2.49KLRCT-ND; Height: 0.40MM; Weight: 0.65mg; Temperature: -55°C+155°C; Datasheet: Y:\MIS_DATABASE\DATASHEETS\RESISTORS\RCXXXXL-SER_MAR18.PDF; Crtd /date: VASANTHA/270516; Chkd/date: VASANTHA/270516; Library Ref: RESISTOR; PCB Footprint: RES0402_0-5
R84 = RESISTOR_Dup6: RES 2.49K 1/16W 1% 0402; Part_type: RESISTORS\FIXED; Mfr_part_number: RC0402FR-072K49L; Mfr_name: YAGEO AMERICA; Mistral Part No: 110016050020-R; Custom_Duty: 15%; Customs_HS_Code: 85332119; Voltage: NA; Project: TMDXCSKCC; Library Ref: RESISTOR; Chkd/date: VASANTHA/270516; Crtd /date: VASANTHA/270516; Datasheet: Y:\MIS_DATABASE\DATASHEETS\RESISTORS\RCXXXXL-SER_MAR18.PDF; Temperature: -55°C+155°C; Weight: 0.65mg; Height: 0.40MM; Distributor_part_number: 311-2.49KLRCT-ND; Distributor_name: DIGIKEY; Package: 0402; Wattage: 1/16W; Tolerance: 1%; Footprint Ref: RES0402_0-5; MECHANICAL 3D STEP FILE: RES0402_0-5; Library Path: Y:\MIS_DATABASE\Library\ALTIUM_TOOL\SCHEMATICS_PARTS\MS_DISCRETE_Library.schlib; Footprint Path: Y:\MIS_DATABASE\Library\ALTIUM_TOOL\PCB_FOOTPRINTS\Altium_Footprint_Lib.PcbLib; PCB Footprint: RES0402_0-5
R189 = RESISTOR_Dup4: RES 0E 1/16W JUMPER 0402; Part_type: RESISTORS\FIXED; Mfr_part_number: CRCW04020000Z0ED; Mfr_name: VISHAY; Mistral Part No: 110010080019-R; Custom_Duty: 15%; Customs_HS_Code: 85332119; Voltage: NA; Project: PB_BUGBASE; MECHANICAL 3D STEP FILE: RES0402_0-5; Chkd/date: VASANTHA/201216; Crtd /date: MUDDU/190810; Datasheet: Y:\MIS_DATABASE\DATASHEETS\RESISTORS\CRCW0603.PDF; Temperature: -55°C+155°C; Weight: 0.65mg; Height: 0.40MM; Distributor_part_number: 541-0.0JCT-ND; Distributor_name: DIGIKEY; Package: 0402; Wattage: 1/16W; Tolerance: NA; Library Ref: RESISTOR; Footprint Ref: RES0402_0-5; Library Path: Y:\MIS_DATABASE\Library\ALTIUM_TOOL\SCHEMATICS_PARTS\MS_DISCRETE_Library.schlib; Footprint Path: Y:\MIS_DATABASE\Library\ALTIUM_TOOL\PCB_FOOTPRINTS\Altium_Footprint_Lib.PcbLib; PCB Footprint: RES0402_0-5
R190-R192 R481 = RESISTOR_Dup6: as R427 on sheet 18; MECHANICAL 3D STEP FILE: RES0201_0-5; Chkd/date: MANIRAJA/050517; Crtd /date: MANIRAJA/050517; Datasheet: Y:\MIS_DATABASE\DATASHEETS\RESISTORS\RCXXXXL-SER_MAR18.PDF; Temperature: -55°C+125°C; Weight: 0.17mg; Height: 0.26MM; Distributor_part_number: 311-10KNCT-ND; Distributor_name: DIGIKEY; Package: 0201; Wattage: 1/20W; Tolerance: 5%; Library Ref: RESISTOR; Footprint Ref: RES0201_0-5; Library Path: Y:\MIS_DATABASE\Library\ALTIUM_TOOL\SCHEMATICS_PARTS\MS_DISCRETE_Library.schlib; Footprint Path: Y:\MIS_DATABASE\Library\ALTIUM_TOOL\PCB_FOOTPRINTS\Altium_Footprint_Lib.PcbLib; PCB Footprint: RES0201_0-5
R339 = RESISTOR_Dup6: RES 0E 1/10W 5% 0603; Manufacturer: YAGEO AMERICA; Mistral Part No: 110011020013-R; Mfr_name: PANASONIC-ECG; Mfr_part_number: RC0603JR-070RL; Part_type: RESISTORS\FIXED; Project: KENNEL; Voltage: NA; Customs_HS_Code: 85332119; Custom_Duty: 15%; Footprint Path: Y:\MIS_DATABASE\Library\ALTIUM_TOOL\PCB_FOOTPRINTS\Altium_Footprint_Lib.PcbLib; Library Path: Y:\MIS_DATABASE\Library\ALTIUM_TOOL\SCHEMATICS_PARTS\MS_DISCRETE_Library.schlib; Footprint Ref: RES0603_0-75; Library Ref: RESISTOR; Tolerance: 5%; Wattage: 1/10W; Package: 0603; Distributor_name: DIGIKEY; Distributor_part_number: 311-0.0GRCT-ND; Height: 0.55MM; Weight: 2mg; Temperature: -55°C+155°C; Datasheet: Y:\MIS_DATABASE\DATASHEETS\RESISTORS\RCXXXXL-SER_MAR18.PDF; Crtd /date: BAVISH/180211; Chkd/date: MANIRAJA/051217; MECHANICAL 3D STEP FILE: RES0603_0-75; PCB Footprint: RES0603_0-75
R341 R342 R371 = RESISTOR_Dup6: RES 220E 1/10W 5% 0402; Part_type: RESISTORS\FIXED; Mfr_part_number: ERJ-2GEJ221X; Mfr_name: PANASONIC-ECG; Mistral Part No: 110009030506-R; Voltage: NA; Custom_Duty: 15%; Customs_HS_Code: 85332119; Project: RED EYE; PCB Footprint: RES0402_0-5; Footprint Path: Y:\MIS_DATABASE\Library\ALTIUM_TOOL\PCB_FOOTPRINTS\Altium_Footprint_Lib.PcbLib; Library Path: Y:\MIS_DATABASE\Library\ALTIUM_TOOL\SCHEMATICS_PARTS\MS_DISCRETE_Library.schlib; MECHANICAL 3D STEP FILE: RES0402_0-5; Temperature: -55°C+155°C; Weight: 0.8mg; Library Ref: RESISTOR; Chkd/date: VASANTHA/291216; Crtd /date: GEETHA/260406; Datasheet: Y:\MIS_DATABASE\DATASHEETS\RESISTORS\PAN-ERJSER_NOV17.PDF; Height: 0.40MM; Distributor_part_number: P220JCT-ND; Distributor_name: DIGIKEY; Package: 0402; Wattage: 1/10W; Tolerance: 5%; Footprint Ref: RES0402_0-5
R349 = RESISTOR_Dup6: RES 5.76K 1/10W 1% 0402; Part_type: RESISTORS\FIXED; Mfr_part_number: ERJ-2RKF5761X; Mfr_name: PANASONIC-ECG; Mistral Part No: 110009030945-R; Voltage: NA; Custom_Duty: 15%; Customs_HS_Code: 85332119; Project: CPB; MECHANICAL 3D STEP FILE: RES0402_0-5; Temperature: -55°C+155°C; Weight: 0.8mg; Footprint Ref: RES0402_0-5; Chkd/date: MAZHAR/150709; Crtd /date: USMAN/220808; Datasheet: Y:\MIS_DATABASE\DATASHEETS\RESISTORS\PAN-ERJSER_NOV17.PDF; Height: 0.40MM; Distributor_part_number: P5.76KLCT-ND; Distributor_name: DIGIKEY; Package: 0402; Wattage: 1/10W; Tolerance: 1%; Library Ref: RESISTOR; Library Path: Y:\MIS_DATABASE\Library\ALTIUM_TOOL\SCHEMATICS_PARTS\MS_DISCRETE_Library.schlib; Footprint Path: Y:\MIS_DATABASE\Library\ALTIUM_TOOL\PCB_FOOTPRINTS\Altium_Footprint_Lib.PcbLib; PCB Footprint: RES0402_0-5
R351 R362 = RESISTOR_Dup6: as R117 on sheet 19; Footprint Ref: RES0201_0-5; Tolerance: 5%; Wattage: 1/20W; Package: 0201; Distributor_name: DIGIKEY; Distributor_part_number: 311-10KNCT-ND; Library Ref: RESISTOR; Height: 0.26MM; Weight: 0.17mg; Temperature: -55°C+125°C; Datasheet: Y:\MIS_DATABASE\DATASHEETS\RESISTORS\RCXXXXL-SER_MAR18.PDF; Crtd /date: MANIRAJA/050517; Chkd/date: MANIRAJA/050517; MECHANICAL 3D STEP FILE: RES0201_0-5; Library Path: Y:\MIS_DATABASE\Library\ALTIUM_TOOL\SCHEMATICS_PARTS\MS_DISCRETE_Library.schlib; Footprint Path: Y:\MIS_DATABASE\Library\ALTIUM_TOOL\PCB_FOOTPRINTS\Altium_Footprint_Lib.PcbLib; PCB Footprint: RES0201_0-5
R352 = RESISTOR_Dup6: RES 2.2K 1/20W 1% 0201; Manufacturer: YAGEO AMERICA; Part_type: RESISTORS\FIXED; Mfr_part_number: RC0201FR-072K2L; Mfr_name: PANASONIC-ECG; Mistral Part No: 110017010016-R; Custom_Duty: 15%; Customs_HS_Code: 85332119; Voltage: NA; Project: GOLDEN-I LITE; Footprint Path: Y:\MIS_DATABASE\Library\ALTIUM_TOOL\PCB_FOOTPRINTS\Altium_Footprint_Lib.PcbLib; Library Path: Y:\MIS_DATABASE\Library\ALTIUM_TOOL\SCHEMATICS_PARTS\MS_DISCRETE_Library.schlib; MECHANICAL 3D STEP FILE: RES0201_0-5; Chkd/date: VASANTHA/270117; Crtd /date: MANIRAJA/270117; Datasheet: Y:\MIS_DATABASE\DATASHEETS\RESISTORS\RCXXXXL-SER_MAR18.PDF; Temperature: -55°C+125°C; Weight: 0.17mg; Height: 0.26MM; Library Ref: RESISTOR; Distributor_part_number: YAG2572CT-ND; Distributor_name: DIGIKEY; Package: 0201; Wattage: 1/20W; Tolerance: 1%; Footprint Ref: RES0201_0-5; PCB Footprint: RES0201_0-5
R353 R354 = RESISTOR_Dup1: RES 22E 1/20W 1% 0201; Part_type: RESISTORS\FIXED; Mfr_part_number: RC0201FR-0722RL; Mfr_name: YAGEO AMERICA; Mistral Part No: 110009030522-R; Custom_Duty: 15%; Customs_HS_Code: 85332119; Voltage: NA; Project: AM654x_SOM; Footprint Path: Y:\MIS_DATABASE\Library\ALTIUM_TOOL\PCB_FOOTPRINTS\Altium_Footprint_Lib.PcbLib; Library Path: Y:\MIS_DATABASE\Library\ALTIUM_TOOL\SCHEMATICS_PARTS\MS_DISCRETE_Library.schlib; MECHANICAL 3D STEP FILE: RES0201_0-5; Chkd/date: MANIRAJA/080319; Crtd /date: ALVY/080319; Datasheet: Y:\MIS_DATABASE\DATASHEETS\RESISTORS\RCXXXXL-SER_MAR18.PDF; Temperature: -55°C+125°C; Weight: 0.17mg; Height: 0.26MM; Library Ref: RESISTOR; Distributor_part_number: YAG2518CT-ND; Distributor_name: DIGIKEY; Package: 0201; Wattage: 1/20W; Tolerance: 1%; Footprint Ref: RES0201_0-5; PCB Footprint: RES0201_0-5
R359 = RESISTOR_Dup6: RES 0E 1/16W JUMPER 0402; Part_type: RESISTORS\FIXED; Mfr_part_number: CRCW04020000Z0ED; Mfr_name: VISHAY; Mistral Part No: 110010080019-R; Custom_Duty: 15%; Customs_HS_Code: 85332119; Voltage: NA; Project: PB_BUGBASE; SIGNAL_MODEL: RESISTOR_RES0402_0-5_0E_0E; Footprint Path: Y:\MIS_DATABASE\Library\ALTIUM_TOOL\PCB_FOOTPRINTS\Altium_Footprint_Lib.PcbLib; Library Path: Y:\MIS_DATABASE\Library\ALTIUM_TOOL\SCHEMATICS_PARTS\MS_DISCRETE_Library.schlib; MECHANICAL 3D STEP FILE: RES0402_0-5; Chkd/date: VASANTHA/201216; Crtd /date: MUDDU/190810; Datasheet: Y:\MIS_DATABASE\DATASHEETS\RESISTORS\CRCW0603.PDF; Temperature: -55°C+155°C; Weight: 0.65mg; Height: 0.40MM; Library Ref: RESISTOR; Distributor_part_number: 541-0.0JCT-ND; Distributor_name: DIGIKEY; Package: 0402; Wattage: 1/16W; Tolerance: NA; Footprint Ref: RES0402_0-5; PCB Footprint: RES0402_0-5
R361 = RESISTOR_Dup6: RES 10K 1/20W 1% 0201; Manufacturer: YAGEO AMERICA; Part_type: RESISTORS\FIXED; Mfr_part_number: RC0201FR-0710KL; Mistral Part No: 110011040018-R; Custom_Duty: 15%; Customs_HS_Code: 85332119; Voltage: NA; Project: GOLDEN-I LITE; PCB Footprint: RES0201_0-5; Footprint Path: Y:\MIS_DATABASE\Library\ALTIUM_TOOL\PCB_FOOTPRINTS\Altium_Footprint_Lib.PcbLib; Library Path: Y:\MIS_DATABASE\Library\ALTIUM_TOOL\SCHEMATICS_PARTS\MS_DISCRETE_Library.schlib; Footprint Ref: RES0201_0-5; MECHANICAL 3D STEP FILE: RES0201_0-5; Chkd/date: VASANTHA/270117; Crtd /date: MANIRAJA/270117; Datasheet: Y:\MIS_DATABASE\DATASHEETS\RESISTORS\RCXXXXL-SER_MAR18.PDF; Temperature: -55°C+125°C; Weight: 0.17mg; Height: 0.26MM; Distributor_part_number: 311-10.0KMCT-ND; Distributor_name: DIGIKEY; Package: 0201; Wattage: 1/20W; Tolerance: 1%; Mfr_name: YAGEO AMERICA; Library Ref: RESISTOR
R363 = RESISTOR_Dup6: RES 2.2K 1/20W 5% 0201; Part_type: RESISTORS\FIXED; Mfr_part_number: ERJ-1GEJ222C; Mfr_name: PANASONIC-ECG; Mistral Part No: 110009030427-R; Custom_Duty: 15%; Customs_HS_Code: 85332119; Voltage: NA; Project: G4SLIM; Footprint Path: Y:\MIS_DATABASE\Library\ALTIUM_TOOL\PCB_FOOTPRINTS\Altium_Footprint_Lib.PcbLib; Library Path: Y:\MIS_DATABASE\Library\ALTIUM_TOOL\SCHEMATICS_PARTS\MS_DISCRETE_Library.schlib; MECHANICAL 3D STEP FILE: RES0201_0-5; Chkd/date: VASANTHA/010117; Crtd /date: MAZHAR/010605; Datasheet: Y:\MIS_DATABASE\DATASHEETS\RESISTORS\PAN-ERJXGE-FEB06.PDF; Temperature: -55°C+125°C; Weight: 0.15mg; Height: 0.26MM; Library Ref: RESISTOR; Distributor_part_number: P2.2KAGCT-ND; Distributor_name: DIGIKEY; Package: 0201; Wattage: 1/20W; Tolerance: 5%; Footprint Ref: RES0201_0-5; PCB Footprint: RES0201_0-5
TP22 TP27 = TESTPOINT: TESTPOINT CIR 20 SMD; Mfr_name: LOCAL; Mistral Part No: NA; Project: BT MODULE_CSRBC04; RoHS: NA; Footprint Ref: TP20_SMD; Library Ref: TESTPOINT; Chkd/date: SHREESHAIL/171006; Crtd /date: MAZHAR/171006; Height: NA; Distributor_part_number: NA; Distributor_name: NA; Package: SMD; Part_type: TESTPOINT; Mfr_part_number: TP20_SMD; Tolerance: NA; Voltage: NA; Wattage: NA; Weight: NA; Temperature: NA; Datasheet: NA; MECHANICAL 3D STEP FILE: NA; Library Path: Y:\MIS_DATABASE\Library\ALTIUM_TOOL\SCHEMATICS_PARTS\MS_DISCRETE_Library.schlib; Footprint Path: Y:\MIS_DATABASE\Library\ALTIUM_TOOL\PCB_FOOTPRINTS\Altium_Footprint_Lib.PcbLib; Customs_HS_Code: NA; Custom_Duty: NA; PCB Footprint: TP20_SMD
TP23 TP24 TP26 TP30 TP32 TP100 TP102 = TESTPOINT: TESTPOINT CIR 20 SMD; Mfr_name: LOCAL; Custom_Duty: NA; Project: BT MODULE_CSRBC04; Customs_HS_Code: NA; Footprint Path: Y:\MIS_DATABASE\Library\ALTIUM_TOOL\PCB_FOOTPRINTS\Altium_Footprint_Lib.PcbLib; Library Path: Y:\MIS_DATABASE\Library\ALTIUM_TOOL\SCHEMATICS_PARTS\MS_DISCRETE_Library.schlib; MECHANICAL 3D STEP FILE: NA; Datasheet: NA; Temperature: NA; Weight: NA; Wattage: NA; Voltage: NA; Tolerance: NA; Mistral Part No: NA; Mfr_part_number: TP20_SMD; Part_type: TESTPOINT; Package: SMD; Distributor_name: NA; Distributor_part_number: NA; Height: NA; Crtd /date: MAZHAR/171006; Chkd/date: SHREESHAIL/171006; Library Ref: TESTPOINT; Footprint Ref: TP20_SMD; RoHS: NA; PCB Footprint: TP20_SMD
U40 = SN74LVC1G11DCKR_SC70-6: as U22 on sheet 19; Footprint Ref: SON6_SN74LVC2G17_40X60_0-6; Mfr_part_number: SN74LVC1G11DRYR; Voltage: NA; Wattage: NA; Package: SON6; Distributor_name: DIGIKEY; Distributor_part_number: 296-30120-1-ND; Library Ref: SN74LVC1G11DCKR_SC70-6; Height: 0.60MM; Weight: 33mg; Temperature: -40°C+125°C; Datasheet: Y:\MIS_DATABASE\DATASHEETS\ICS\DIGITAL\GATES\SN74LVC1G_NOV16.PDF; Crtd /date: ALVY/270121; Chkd/date: MANIRAJA/270121; MECHANICAL 3D STEP FILE: SON6_SN74LVC2G17_40X60_0-6; Library Path: Y:\MIS_DATABASE\Library\ALTIUM_TOOL\SCHEMATICS_PARTS\MS_GATE_Library.schlib; Footprint Path: Y:\MIS_DATABASE\Library\ALTIUM_TOOL\PCB_FOOTPRINTS\Altium_Footprint_Lib.PcbLib; PCB Footprint: SON6_SN74LVC2G17_40X60_0-6
U51 = DP83867IRRGZ_VQFN48: IC HIGH IMMUNITY 10/100/1000 Mb/s ETHERNET PHY LAYER TRANSCEIVER VQFN48; Part_type: ICS\TELECOM\TRANSCEIVER; Mfr_name: TEXAS INSTRUMENTS; Mistral Part No: 143017080002-R; Custom_Duty: 15%; Customs_HS_Code: 85423100; Wattage: NA; Project: TI_SVB_CONTROLLER CARD; PCB Footprint: QFN48_19-68_280X280_1; MECHANICAL 3D STEP FILE: QFN48_19-68_280X280_1; Chkd/date: MANIRAJA/110817; Crtd /date: MANIRAJA/110817; Datasheet: Y:\MIS_DATABASE\DATASHEETS\ICS\DIGITAL\BUSTRANSCEIVER\DP83867I.PDF; Temperature: -40°C+85°C; Weight: NA; Height: 1.00MM; Distributor_part_number: DP83867IRRGZT-ND; Distributor_name: DIGIKEY; Package: VQFN48; Voltage: NA; Tolerance: NA; Mfr_part_number: DP83867IRRGZ; Library Ref: DP83867IRRGZ_VQFN48